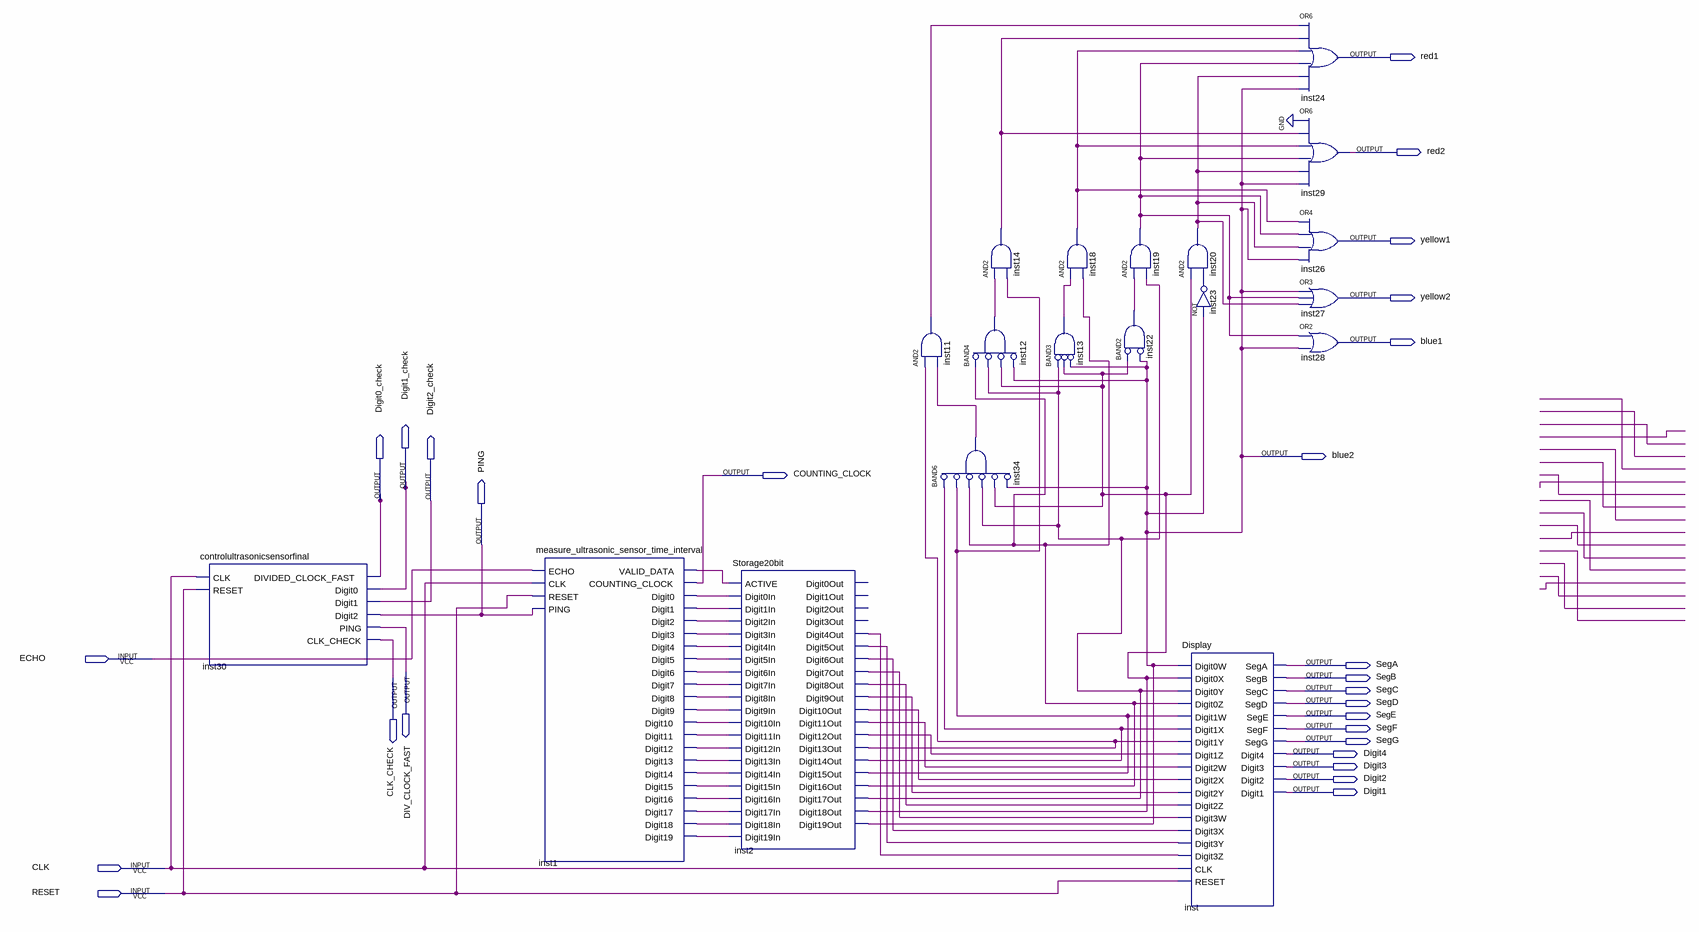
[diagram p0: schematic sheet]
// Quartus schematic distanceMeasure.bdf as structural Verilog: 19 symbols, 27 pins
module distanceMeasure (
  input  ECHO,
  input  CLK,
  input  RESET,
  output red1,
  output red2,
  output yellow1,
  output yellow2,
  output blue1,
  output blue2,
  output COUNTING_CLOCK,
  output Digit1_check,
  output Digit0_check,
  output Digit2_check,
  output PING,
  output SegA,
  output DIV_CLOCK_FAST,
  output CLK_CHECK,
  output SegB,
  output SegC,
  output SegD,
  output SegE,
  output SegF,
  output SegG,
  output Digit4,
  output Digit3,
  output Digit2,
  output Digit1
);

  wire inst1_digit0, inst1_digit1, inst1_digit2, inst1_digit3, inst1_digit4, inst1_digit5, inst1_digit6,
       inst1_digit7, inst1_digit8, inst1_digit9, inst1_digit10, inst1_digit11, inst1_digit12, inst1_digit13,
       inst1_digit14, inst1_digit15, inst1_digit16, inst1_digit17, inst1_digit18, inst1_digit19,
       inst1_valid_data, inst2_digit4out, inst2_digit5out, inst2_digit6out, inst2_digit7out, inst2_digit8out,
       inst2_digit9out, inst2_digit10out, inst2_digit11out, inst2_digit12out, inst2_digit13out,
       inst2_digit14out, inst2_digit15out, inst2_digit16out, inst2_digit17out, inst2_digit18out, inst11_out,
       inst12_out, inst13_out, inst14_out, inst18_out, inst19_out, inst20_out, inst22_out, inst23_out,
       inst34_out;

  controlultrasonicsensorfinal inst30 (
    .CLK(CLK), .RESET(RESET), .DIVIDED_CLOCK_FAST(Digit0_check), .Digit0(Digit1_check),
    .Digit1(Digit2_check), .Digit2(PING), .PING(DIV_CLOCK_FAST), .CLK_CHECK(CLK_CHECK));
  measure_ultrasonic_sensor_time_interval inst1 (
    .ECHO(ECHO), .CLK(CLK), .RESET(RESET), .PING(PING), .VALID_DATA(inst1_valid_data),
    .COUNTING_CLOCK(COUNTING_CLOCK), .Digit0(inst1_digit0), .Digit1(inst1_digit1), .Digit2(inst1_digit2),
    .Digit3(inst1_digit3), .Digit4(inst1_digit4), .Digit5(inst1_digit5), .Digit6(inst1_digit6),
    .Digit7(inst1_digit7), .Digit8(inst1_digit8), .Digit9(inst1_digit9), .Digit10(inst1_digit10),
    .Digit11(inst1_digit11), .Digit12(inst1_digit12), .Digit13(inst1_digit13), .Digit14(inst1_digit14),
    .Digit15(inst1_digit15), .Digit16(inst1_digit16), .Digit17(inst1_digit17), .Digit18(inst1_digit18),
    .Digit19(inst1_digit19));
  Storage20bit inst2 (
    .ACTIVE(inst1_valid_data), .Digit0In(inst1_digit0), .Digit1In(inst1_digit1), .Digit2In(inst1_digit2),
    .Digit3In(inst1_digit3), .Digit4In(inst1_digit4), .Digit5In(inst1_digit5), .Digit6In(inst1_digit6),
    .Digit7In(inst1_digit7), .Digit8In(inst1_digit8), .Digit9In(inst1_digit9), .Digit10In(inst1_digit10),
    .Digit11In(inst1_digit11), .Digit12In(inst1_digit12), .Digit13In(inst1_digit13),
    .Digit14In(inst1_digit14), .Digit15In(inst1_digit15), .Digit16In(inst1_digit16),
    .Digit17In(inst1_digit17), .Digit18In(inst1_digit18), .Digit19In(inst1_digit19),
    .Digit4Out(inst2_digit4out), .Digit5Out(inst2_digit5out), .Digit6Out(inst2_digit6out),
    .Digit7Out(inst2_digit7out), .Digit8Out(inst2_digit8out), .Digit9Out(inst2_digit9out),
    .Digit10Out(inst2_digit10out), .Digit11Out(inst2_digit11out), .Digit12Out(inst2_digit12out),
    .Digit13Out(inst2_digit13out), .Digit14Out(inst2_digit14out), .Digit15Out(inst2_digit15out),
    .Digit16Out(inst2_digit16out), .Digit17Out(inst2_digit17out), .Digit18Out(inst2_digit18out),
    .Digit19Out(blue2));  // open: Digit0Out, Digit1Out, Digit2Out, Digit3Out
  and inst11 (inst11_out, inst2_digit13out, inst34_out);
  and inst12 (inst12_out, ~inst2_digit16out, ~inst2_digit17out, ~inst2_digit18out, ~blue2);  // BAND4
  and inst34 (inst34_out, ~inst2_digit14out, ~inst2_digit15out, ~inst2_digit16out, ~inst2_digit17out, ~inst2_digit18out, ~blue2);  // BAND6
  and inst14 (inst14_out, inst12_out, inst2_digit15out);
  and inst18 (inst18_out, inst13_out, inst2_digit16out);
  and inst13 (inst13_out, ~inst2_digit17out, ~inst2_digit18out, ~blue2);  // BAND3
  and inst19 (inst19_out, inst22_out, inst2_digit17out);
  and inst22 (inst22_out, ~inst2_digit18out, ~blue2);  // BAND2
  and inst20 (inst20_out, inst2_digit18out, inst23_out);
  not inst23 (inst23_out, blue2);
  Display inst (
    .Digit0W(blue2), .Digit0X(inst2_digit18out), .Digit0Y(inst2_digit17out), .Digit0Z(inst2_digit16out),
    .Digit1W(inst2_digit15out), .Digit1X(inst2_digit14out), .Digit1Y(inst2_digit13out),
    .Digit1Z(inst2_digit12out), .Digit2W(inst2_digit11out), .Digit2X(inst2_digit10out),
    .Digit2Y(inst2_digit9out), .Digit2Z(inst2_digit8out), .Digit3W(inst2_digit7out),
    .Digit3X(inst2_digit6out), .Digit3Y(inst2_digit5out), .Digit3Z(inst2_digit4out), .CLK(CLK),
    .RESET(RESET), .SegA(SegA), .SegB(SegB), .SegC(SegC), .SegD(SegD), .SegE(SegE), .SegF(SegF), .SegG(SegG),
    .Digit4(Digit4), .Digit3(Digit3), .Digit2(Digit2), .Digit1(Digit1));
  or inst24 (red1, inst11_out, inst14_out, inst18_out, inst19_out, inst20_out, blue2);
  or inst29 (red2, 1'b0, inst14_out, inst18_out, inst19_out, inst20_out, blue2);
  or inst26 (yellow1, inst18_out, inst19_out, inst20_out, blue2);
  or inst27 (yellow2, blue2, inst19_out, inst20_out);
  or inst28 (blue1, inst19_out, blue2);
endmodule
